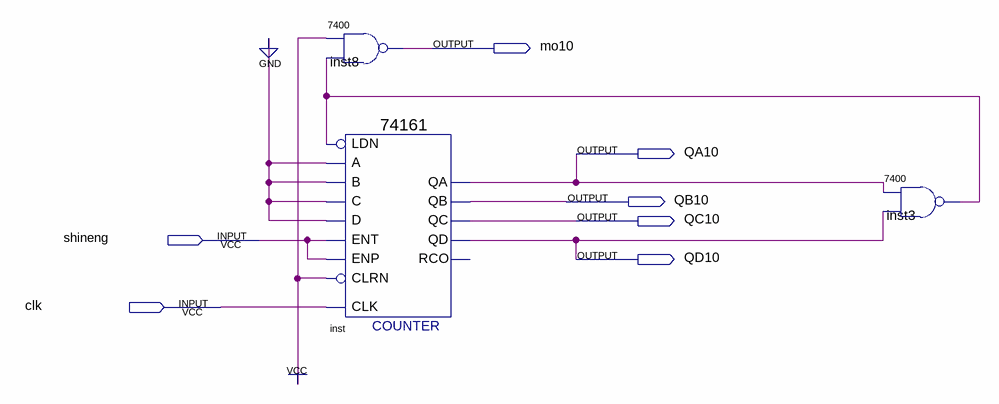
[diagram p0: schematic sheet]
// Quartus schematic mo10tongbu.bdf as structural Verilog: 3 symbols, 7 pins
module mo10tongbu (
  input  shineng,
  input  clk,
  output mo10,
  output QA10,
  output QB10,
  output QC10,
  output QD10
);

  wire inst3_1;

  \7400  inst8 (.\3 (inst3_1), .\2 (1'b1), .\1 (mo10));
  \74161  inst (
    .CLRN(1'b1), .CLK(clk), .ENP(shineng), .LDN(inst3_1), .A(1'b0), .D(1'b0), .ENT(shineng), .B(1'b0),
    .C(1'b0), .QD(QD10), .QC(QC10), .QB(QB10), .QA(QA10));  // open: RCO
  \7400  inst3 (.\3 (QD10), .\2 (QA10), .\1 (inst3_1));
endmodule
